# Altium schematic sheet TIA.SchDoc
size A4
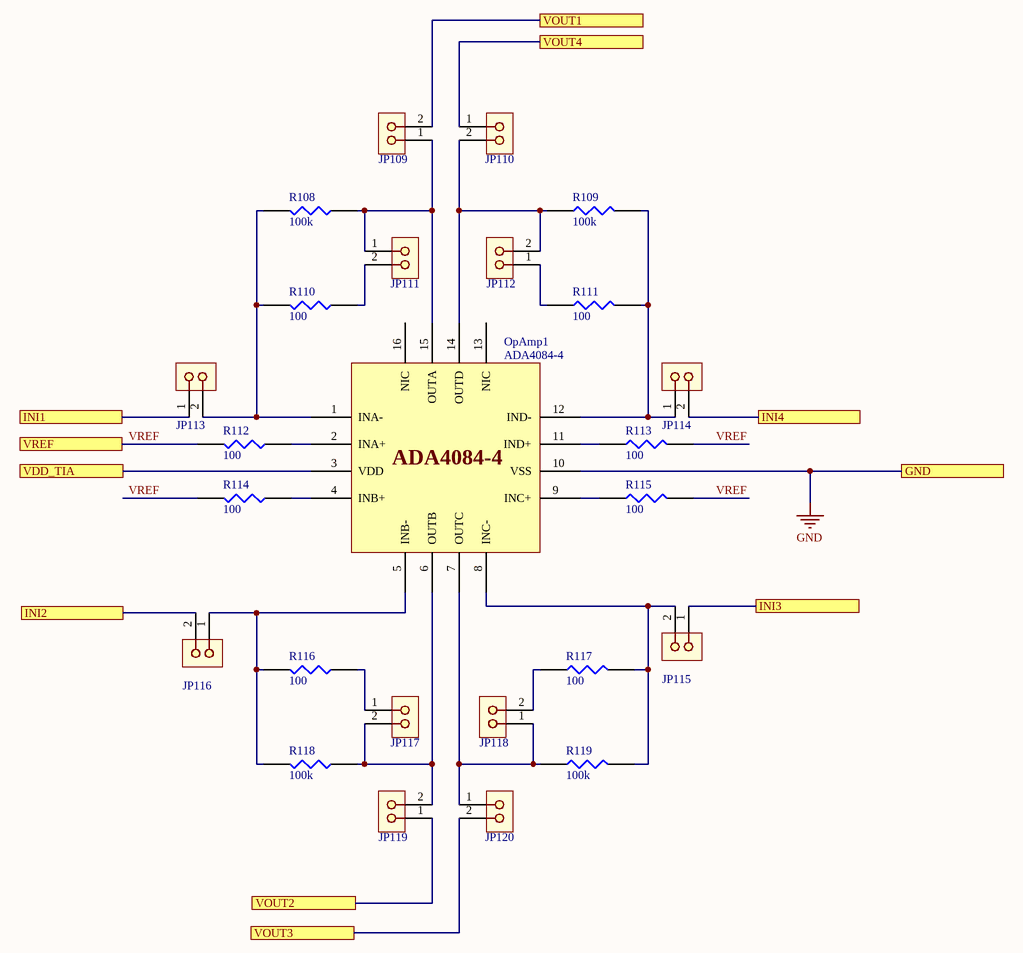
[diagram p0: TIA.SchDoc]

## Parts
JP109  01x02  [01x02_0.1in_th_straight_b_nom]  (value not drawn)
JP110  01x02  [01x02_0.1in_th_straight_b_nom]  (value not drawn)
JP111  01x02  [01x02_0.1in_th_straight_b_nom]  (value not drawn)
JP112  01x02  [01x02_0.1in_th_straight_b_nom]  (value not drawn)
JP113  01x02  [01x02_0.1in_th_straight_b_nom]  (value not drawn)
JP114  01x02  [01x02_0.1in_th_straight_b_nom]  (value not drawn)
JP115  01x02  [01x02_0.1in_th_straight_b_nom]  (value not drawn)
JP116  01x02  [01x02_0.1in_th_straight_b_nom]  (value not drawn)
JP117  01x02  [01x02_0.1in_th_straight_b_nom]  (value not drawn)
JP118  01x02  [01x02_0.1in_th_straight_b_nom]  (value not drawn)
JP119  01x02  [01x02_0.1in_th_straight_b_nom]  (value not drawn)
JP120  01x02  [01x02_0.1in_th_straight_b_nom]  (value not drawn)
OpAmp1  ADA4084-4  [ADA4084-4]
R108  100k  [R0805]
R109  100k  [R0805]
R110  100  [R0805]
R111  100  [R0805]
R112  100  [R0805]
R113  100  [R0805]
R114  100  [R0805]
R115  100  [R0805]
R116  100  [R0805]
R117  100  [R0805]
R118  100k  [R0805]
R119  100k  [R0805]

## Ports
GND, INI1, INI2, INI3, INI4, VDD_TIA, VOUT1, VOUT2, VOUT3, VOUT4, VREF

## Nets
GND: OpAmp1.10(VSS) ; port GND
INI1: JP113.1 ; port INI1
INI2: JP116.2 ; port INI2
INI3: JP115.1 ; port INI3
INI4: JP114.2 ; port INI4
VDD_TIA: OpAmp1.3(VDD) ; port VDD_TIA
VOUT1: JP109.2 ; port VOUT1
VOUT2: JP119.1 ; port VOUT2
VOUT3: JP120.2 ; port VOUT3
VOUT4: JP110.1 ; port VOUT4
VREF: R112.2 R113.2 R114.2 R115.2 ; port VREF
NetJP109_1: JP109.1 JP111.1 OpAmp1.15(OUTA) R108.1
NetJP110_2: JP110.2 JP112.2 OpAmp1.14(OUTD) R109.1
NetJP111_2: JP111.2 R110.1
NetJP112_1: JP112.1 R111.1
NetJP113_2: JP113.2 OpAmp1.1(INA-) R108.2 R110.2
NetJP114_1: JP114.1 OpAmp1.12(IND-) R109.2 R111.2
NetJP115_2: JP115.2 OpAmp1.8(INC-) R117.2 R119.2
NetJP116_1: JP116.1 OpAmp1.5(INB-) R116.2 R118.2
NetJP117_1: JP117.1 R116.1
NetJP117_2: JP117.2 JP119.2 OpAmp1.6(OUTB) R118.1
NetJP118_1: JP118.1 JP120.1 OpAmp1.7(OUTC) R119.1
NetJP118_2: JP118.2 R117.1
NetOpAmp1_2: OpAmp1.2(INA+) R112.1
NetOpAmp1_4: OpAmp1.4(INB+) R114.1
NetOpAmp1_9: OpAmp1.9(INC+) R115.1
NetOpAmp1_11: OpAmp1.11(IND+) R113.1

Not connected (* = marked no-connect by the designer): OpAmp1 13(NIC) 16(NIC)

## Library data of the parts
JP109-JP120 = 01x02: 01X02 generic terminal connector
OpAmp1 = ADA4084-4: Quad Ultra-Precision Op Amps
R108 R109 R118 R119 = Res 100k
R110-R117 = Res 100